# EAGLE design boardv1 (EAGLE 7.4.0)
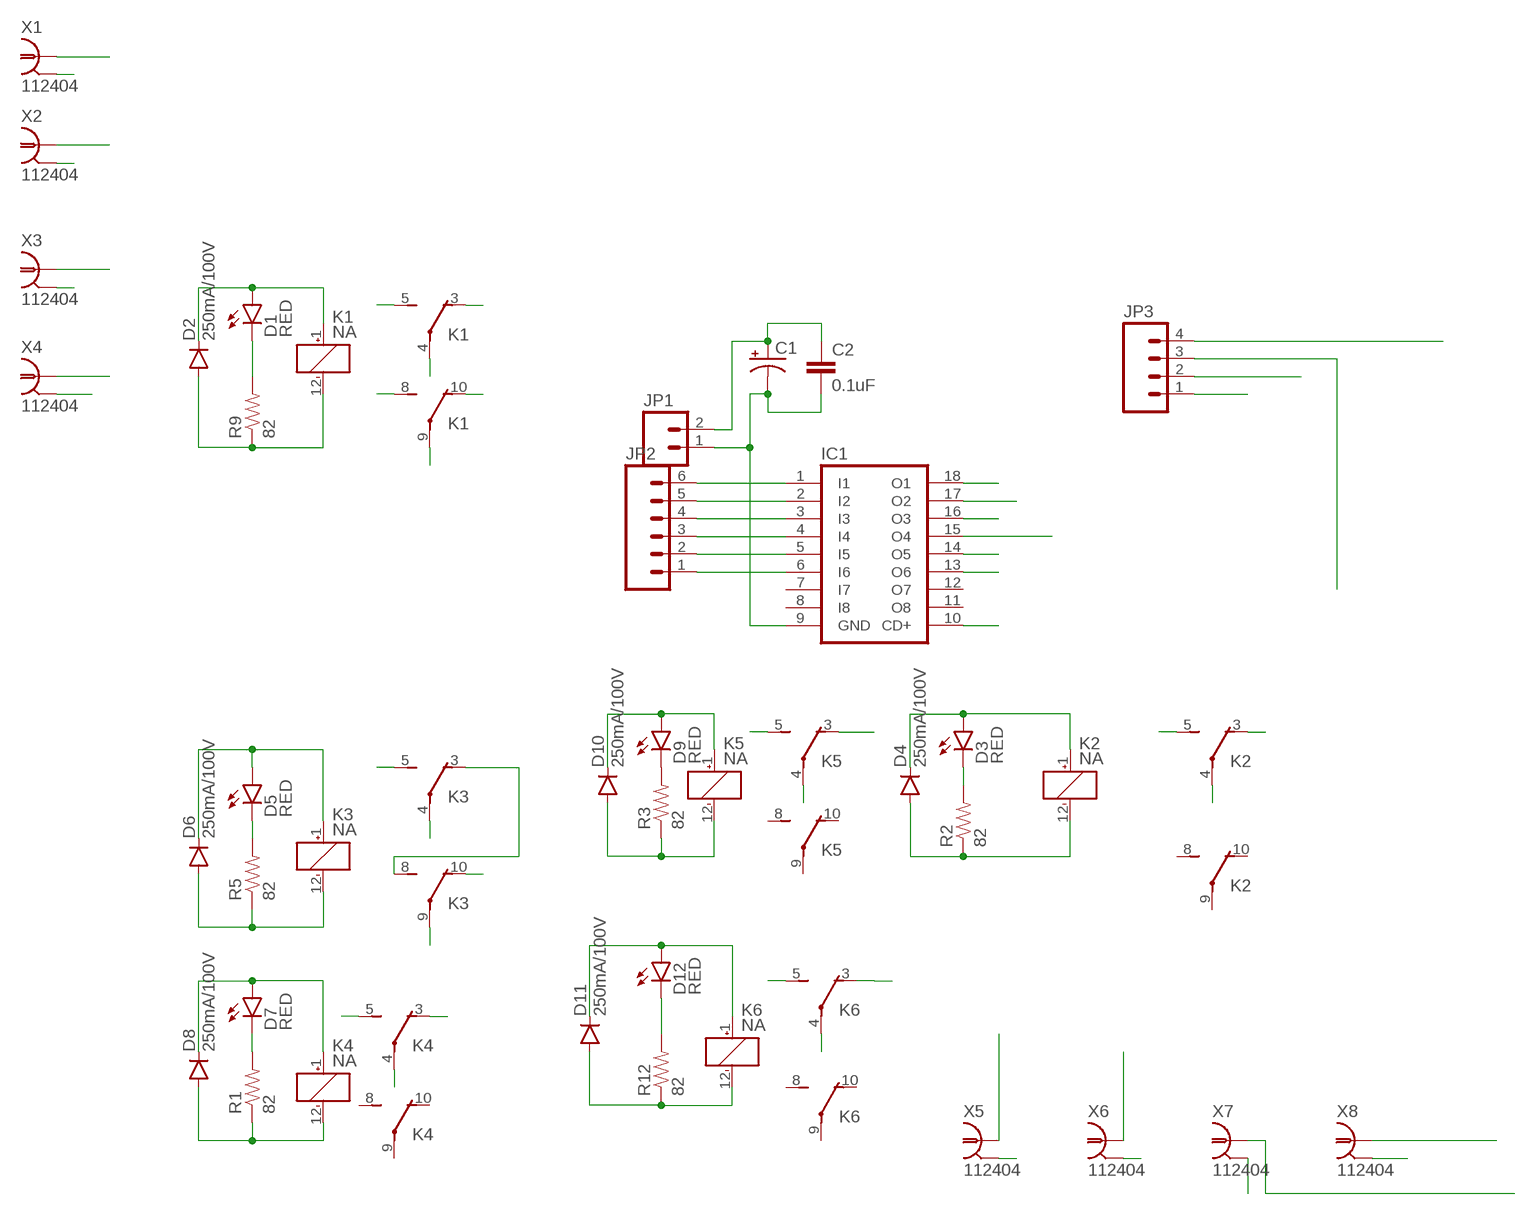
[diagram p0: schematic, sheet 1]

## Parts
C1  100UF-25V-20%(PTH)  [CPOL-RADIAL-100UF-25V]
C2  0.1uF  0.1UF-25V-5%(0603)  [0603-CAP]
D1  RED  LED-RED1206  [LED-1206]
D2  250mA/100V  DIODEBAS16  [SOD-323]
D3  RED  LED-RED1206  [LED-1206]
D4  250mA/100V  DIODEBAS16  [SOD-323]
D5  RED  LED-RED1206  [LED-1206]
D6  250mA/100V  DIODEBAS16  [SOD-323]
D7  RED  LED-RED1206  [LED-1206]
D8  250mA/100V  DIODEBAS16  [SOD-323]
D9  RED  LED-RED1206  [LED-1206]
D10  250mA/100V  DIODEBAS16  [SOD-323]
D11  250mA/100V  DIODEBAS16  [SOD-323]
D12  RED  LED-RED1206  [LED-1206]
IC1  ULN2803A  [DIL18]
JP1  M02PTH  [1X02]
JP2  M06NO_SILK_YES_STOP  [1X06_NO_SILK_YES_STOP]
JP3  M04PTH  [1X04]
K1  NA  [NA]
K2  NA  [NA]
K3  NA  [NA]
K4  NA  [NA]
K5  NA  [NA]
K6  NA  [NA]
R1  82  82OHM-1/10W-1%(0603)SMD  [0603-RES]
R2  82  82OHM-1/10W-1%(0603)SMD  [0603-RES]
R3  82  82OHM-1/10W-1%(0603)SMD  [0603-RES]
R5  82  82OHM-1/10W-1%(0603)SMD  [0603-RES]
R9  82  82OHM-1/10W-1%(0603)SMD  [0603-RES]
R12  82  82OHM-1/10W-1%(0603)SMD  [0603-RES]
X1  112404  [112404]
X2  112404  [112404]
X3  112404  [112404]
X4  112404  [112404]
X5  112404  [112404]
X6  112404  [112404]
X7  112404  [112404]
X8  112404  [112404]

## Nets
ARDUINO1: JP3.4 K2.3(2:O)
ARDUINO2: JP3.3 K6.3(2:O)
ARDUINO3: JP3.2 K5.3(2:O)
ARDUINO4: JP3.1 K4.3(2:O)
GND: X1.2 X1.3 X1.4 X1.5 X2.2 X2.3 X2.4 X2.5 X3.2 X3.3 X3.4 X3.5 X4.2 X4.3 X4.4 X4.5 X5.2 X5.3 X5.4 X5.5 X6.2 X6.3 X6.4 X6.5 X7.2 X7.3 X7.4 X7.5 X8.2 X8.3 X8.4 X8.5
GND2: C1.2(-) C2.2 IC1.9(GND) JP1.1
INPUTA: K1.4(2:P) X1.1
INPUTB: K1.9(3:P) X2.1
N$3: D1.C R9.2
N$4: D12.C R12.2
N$5: D5.C R5.2
N$6: D9.C R3.2
N$7: D7.C R1.2
N$8: IC1.6(I6) JP2.1
N$9: IC1.1(I1) JP2.6
N$10: IC1.2(I2) JP2.5
N$11: IC1.3(I3) JP2.4
N$14: D3.C R2.2
N$24: IC1.4(I4) JP2.3
N$25: IC1.5(I5) JP2.2
OUTPUT1: K4.4(2:P) X5.1
OUTPUT2: K5.4(2:P) X6.1
OUTPUT3: K6.4(2:P) X7.1
OUTPUT4: K2.4(2:P) X8.1
OUTPUTA: K1.3(2:O) K3.5(2:S) X3.1
OUTPUTB: K1.10(3:O) K3.10(3:O) X4.1
R1: D4.A IC1.18(O1) K2.12(1:-) R2.1
R2: D11.A IC1.17(O2) K6.12(1:-) R12.1
R3: D10.A IC1.16(O3) K5.12(1:-) R3.1
R4: D8.A IC1.15(O4) K4.12(1:-) R1.1
R5: D6.A IC1.14(O5) K3.12(1:-) R5.1
R6: D2.A IC1.13(O6) K1.12(1:-) R9.1
SIG3A: K1.5(2:S) K3.4(2:P)
SIG3B: K1.8(3:S) K3.9(3:P)
SIG4A: K2.5(2:S) K3.3(2:O) K3.8(3:S) K4.5(2:S) K5.5(2:S) K6.5(2:S)
VCC: C1.1(+) C2.1 D1.A D2.C D3.A D4.C D5.A D6.C D7.A D8.C D9.A D10.C D11.C D12.A IC1.10(CD+) JP1.2 K1.1(1:+) K2.1(1:+) K3.1(1:+) K4.1(1:+) K5.1(1:+) K6.1(1:+)
Unconnected: IC1.7(I7) IC1.8(I8) IC1.11(O8) IC1.12(O7) K2.8(3:S) K2.9(3:P) K2.10(3:O) K4.8(3:S) K4.9(3:P) K4.10(3:O) K5.8(3:S) K5.9(3:P) K5.10(3:O) K6.8(3:S) K6.9(3:P) K6.10(3:O)

## Library data of the parts
C1 = SparkFun-Capacitors:100UF-25V-20%(PTH): CAP-08439; PROD_ID: CAP-08439
C2 = SparkFun-Capacitors:0.1UF-25V-5%(0603): CAP-08604; PROD_ID: CAP-08604
D1 D3 D5 D7 D9 D12 = SparkFun-LED:LED-RED: Assorted Red LEDs LilyPad 1206- DIO-09912 1206- DIO-00809 0603- DIO-00819 "SMART" means more efficient and expensive; PROD_ID: DIO-09912
D2 D4 D6 D8 D10 D11 = SparkFun-DiscreteSemi:DIODE: Diode These are standard reverse protection diodes and small signal diodes. SMA package can handle up to about 1A. SOD-323 can handle about 200mA. What the SOD-323 package when ordering, there are some mfgs out there that are 5-pin packages.; PROD_ID: DIO-09646
IC1 = uln-udn:ULN2803A: DRIVER ARRAY
JP1 = SparkFun-Connectors:M02: Standard 2-pin 0.1" header. Use with - straight break away headers ( PRT-00116) - right angle break away headers (PRT-00553) - swiss pins (PRT-00743) - machine pins (PRT-00117) - female headers (PRT-00115) Molex polarized connector foot print use with: PRT-08233 with associated crimp pins and housings. 2.54_SCREWTERM for use with PRT-10571. 3.5mm Screw Terminal footprints for PRT-08084 5mm Screw Terminal footprints for use with PRT-08432
JP2 = SparkFun-Connectors:M06: Header 6 Standard 6-pin 0.1" header. Use with straight break away headers (SKU : PRT-00116), right angle break away headers (PRT-00553), swiss pins (PRT-00743), machine pins (PRT-00117), and female headers (PRT-00115). Molex polarized connector foot print use with SKU : PRT-08094 with associated crimp pins and housings. NOTES ON THE VARIANTS LOCK and LOCK_LONGPADS... This footprint was designed to help hold the alignment of a through-hole component (i.e. 6-pin header) while soldering it into place. You may notice that each hole has been shifted either up or down by 0.005 of an inch from it's more standard position (which is a perfectly straight line). This slight alteration caused the pins (the squares in the middle) to touch the edges of the holes. Because they are alternating, it causes a "brace" to hold the component in place. 0.005 has proven to be the perfect amount of "off-center" position when using our standard breakaway headers. Although looks a little odd when you look at the bare footprint, once you have a header in there, the alteration is very hard to notice. Also,if you push a header all the way into place, it is covered up entirely on the bottom side. This idea of altering the position of holes to aid alignment will be further integrated into the Sparkfun Library for other footprints. It can help hold any component with 3 or more connection pins.
JP3 = SparkFun-Connectors:M04: Header 4 Standard 4-pin 0.1" header. Use with straight break away headers (SKU : PRT-00116), right angle break away headers (PRT-00553), swiss pins (PRT-00743), machine pins (PRT-00117), and female headers (PRT-00115). Molex polarized connector foot print use with SKU : PRT-08231 with associated crimp pins and housings. 1MM SMD Version SKU: PRT-10208
K1-K6 = relay:NA: RELAY; OC_FARNELL: unknown; OC_NEWARK: unknown
R1-R3 R5 R9 R12 = SparkFun-Resistors:82OHM-1/10W-1%(0603): RES-12311; PROD_ID: RES-12311
X1-X8 = amphenol-112404_10:112404: Amphenol Connex 112404 BNC P. C. Mount Recept. Jack Source: http://www.amphenolconnex.com/media/downloads/3157/112404.pdf; MF: Amphenol Connex; MPN: 112404; OC_FARNELL: 1583381; OC_NEWARK: 99H4363

## Board
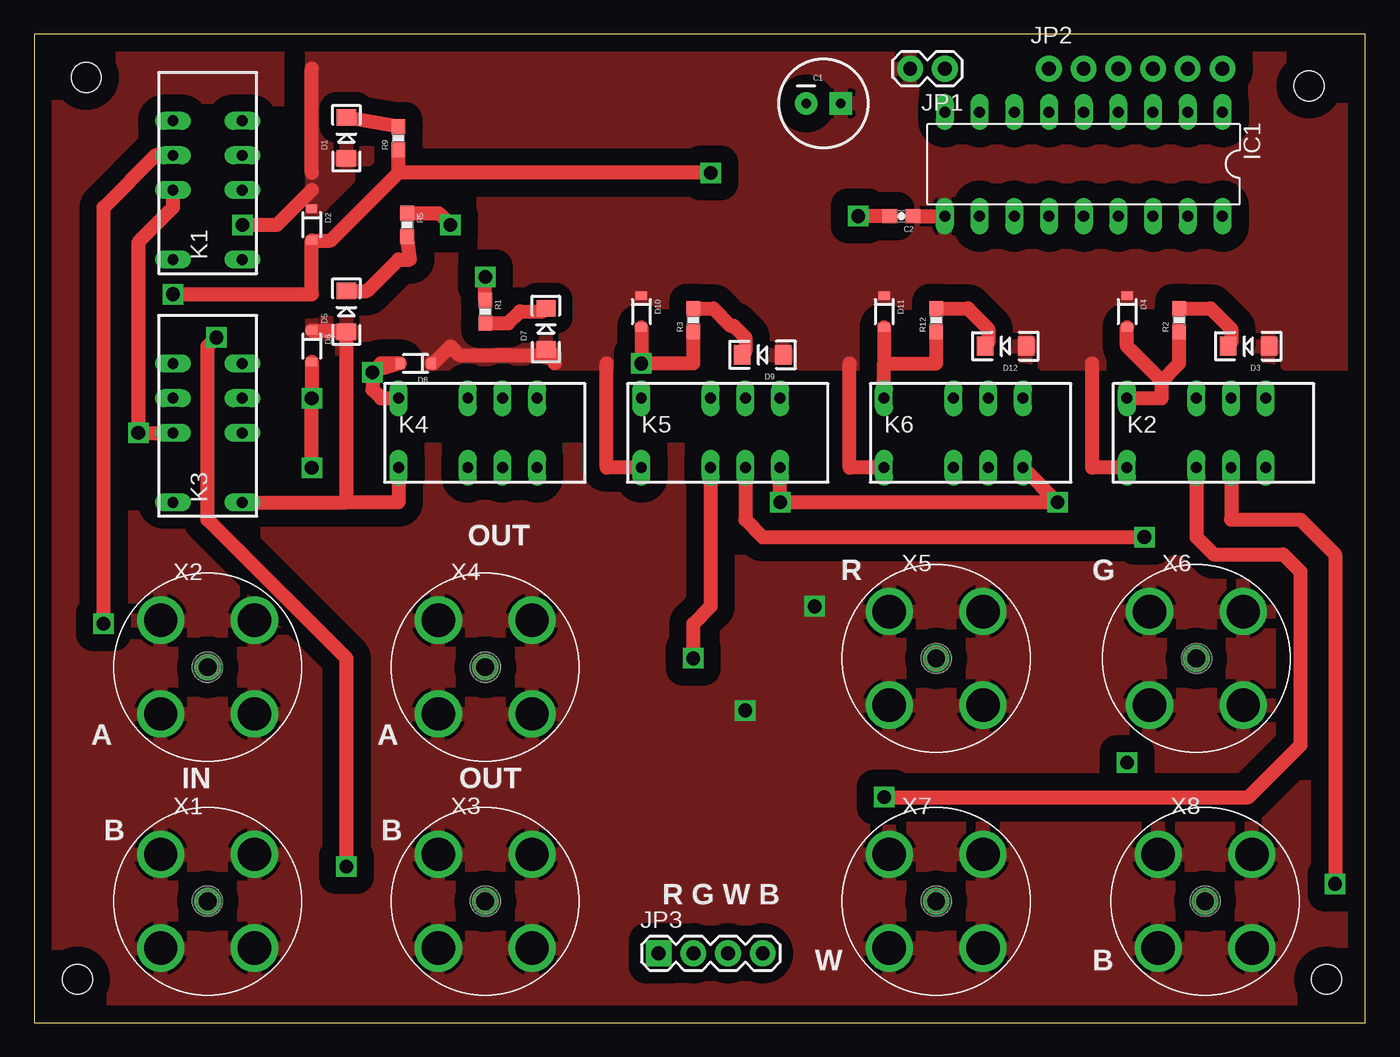
[diagram p1: board, top side]
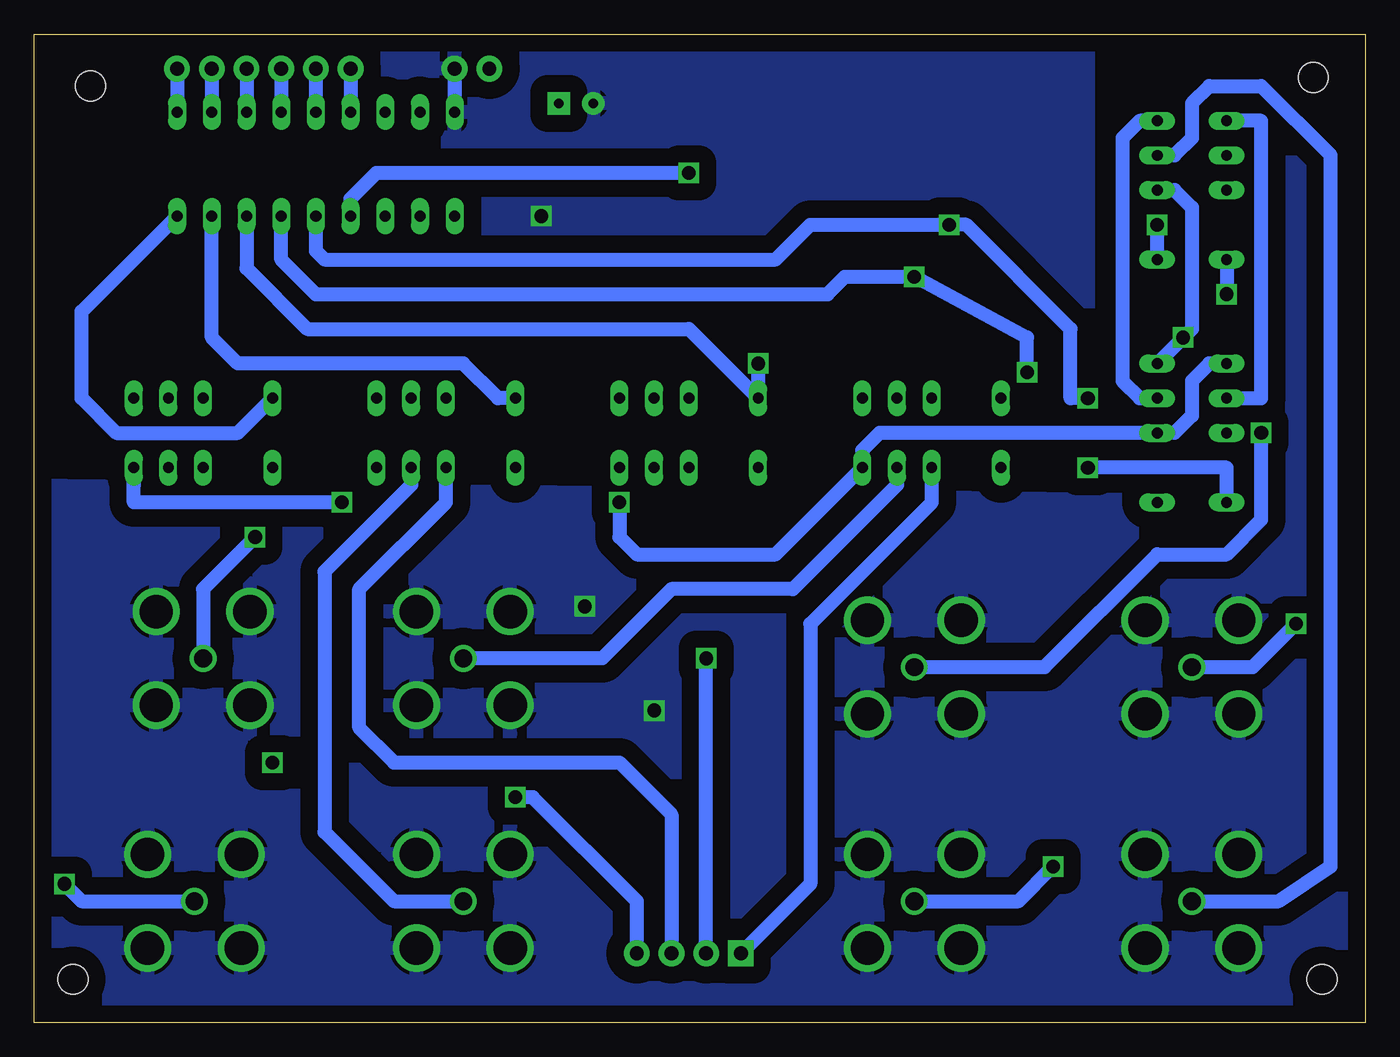
[diagram p2: board, bottom side, seen from below]

Size 97.46 x 72.38 mm. Coordinates in mm from the lower left corner, seen from the top.
Outline: 0,0 97.46,0 97.46,72.38 0,72.38 0,0
Copper layers (1*16): Top 0.035mm / dielectric 1.5mm / Bottom 0.035mm
Design rules "default": minimum track width 10mil, minimum drill 24mil, track to track 8mil, track to pad 8mil, pad to pad 8mil, via to via 8mil, smd to smd 8mil, copper to edge 40mil, drill to drill 8mil, minimum pad ring 10mil, minimum via ring 8mil, stop-mask expansion 4mil, vias tented up to drill 0mil, thermal gap 10mil
Holes 2.2 mm at 3.81,69.22 3.18,3.17 93.34,68.58 94.62,3.17

### Footprints (pad centres in the part's own frame; a part is rotated, then mirrored left to right if it is on the bottom)
CPOL-RADIAL-100UF-25V = drill 0.7 pad 1.651 square: 1 1.27,0 | drill 0.7 pad 1.651: 2 -1.27,0
0603-CAP = smd 1.1 x 1: 1 -0.85,0; 2 0.85,0
LED-1206 = smd 1.2 x 1.4: A -1.5,0; C 1.5,0
SOD-323 = smd 0.63 x 0.83: A 1.15,0; C -1.15,0
DIL18 = drill 0.813 long: 1 -10.16,-3.81; 2 -7.62,-3.81; 3 -5.08,-3.81; 4 -2.54,-3.81; 5 0,-3.81; 6 2.54,-3.81; 7 5.08,-3.81; 8 7.62,-3.81; 9 10.16,-3.81; 10 10.16,3.81; 11 7.62,3.81; 12 5.08,3.81; 13 2.54,3.81; 14 0,3.81; 15 -2.54,3.81; 16 -5.08,3.81; 17 -7.62,3.81; 18 -10.16,3.81
1X02 = drill 1.016 pad 1.88: 1 0,0; 2 2.54,0
1X06_NO_SILK_YES_STOP = drill 1.016 pad 1.88: 1 0,0; 2 2.54,0; 3 5.08,0; 4 7.62,0; 5 10.16,0; 6 12.7,0
1X04 = drill 1.016 pad 1.88 square: 1 0,0 | drill 1.016 pad 1.88: 2 2.54,0; 3 5.08,0; 4 7.62,0
NA = drill 0.8 long: 1 -6.35,-2.54; 3 -1.27,-2.54; 4 1.27,-2.54; 5 3.81,-2.54; 8 3.81,2.54; 9 1.27,2.54; 10 -1.27,2.54; 12 -6.35,2.54
0603-RES = smd 1.1 x 1: 1 -0.85,0; 2 0.85,0
112404 = drill 1.3: 1 0,0 | drill 2.44: 2 -3.43,3.43; 3 3.43,3.43; 4 3.43,-3.43; 5 -3.43,-3.43

### Placement (x,y rotation side)
C1  57.78,67.31 0 top
C2  63.5,59.05 180 top
D1  22.86,64.77 90 top
D2  20.32,58.42 270 top
D3  88.9,49.53 180 top
D4  80.01,52.07 270 top
D5  22.86,52.07 90 top
D6  20.32,49.53 270 top
D7  37.46,50.8 90 top
D8  27.94,48.26 180 top
D9  53.34,48.9 180 top
D10  44.45,52.07 270 top
D11  62.23,52.07 270 top
D12  71.12,49.53 180 top
IC1  76.84,62.87 180 top
JP1  66.67,69.85 180 top
JP2  74.3,69.85 0 top
JP3  45.72,5.08 0 top
K1  12.7,62.23 90 top
K2  86.36,43.18 0 top
K3  12.7,44.45 90 top
K4  33.02,43.18 0 top
K5  50.8,43.18 0 top
K6  68.58,43.18 0 top
R1  33.02,52.07 270 top
R2  83.82,51.44 90 top
R3  48.26,51.44 90 top
R5  27.3,58.42 270 top
R9  26.67,64.77 90 top
R12  66.04,51.44 90 top
X1  12.7,8.89 0 top
X2  12.7,26.04 0 top
X3  33.02,8.89 0 top
X4  33.02,26.04 0 top
X5  66.04,26.67 0 top
X6  85.09,26.67 0 top
X7  66.04,8.89 0 top
X8  85.73,8.89 0 top

### Tracks (layer width: path | path; a pad name or v marks a point on that pad's centre or on a via)
ARDUINO1  (via drill 1)
  Top 1.016: K2.3 85.09,35.56 86.36,34.29 91.44,34.29 92.71,33.02 92.71,20.32 88.9,16.51 v62.23,16.51
  Bottom 1.016: JP3.4 53.34,8.89 60.96,16.51 v62.23,16.51
ARDUINO2
  Bottom 1.016: K6.3 67.31,38.1 73.66,31.75 73.66,21.59 71.12,19.05 54.61,19.05 50.8,15.24 JP3.3
ARDUINO3  (via drill 1)
  Top 1.016: K5.3 49.53,30.48 48.26,29.21 v48.26,26.67
  Bottom 1.016: JP3.2 v48.26,26.67
ARDUINO4
  Bottom 1.016: K4.3 31.75,38.1 40.64,29.21 40.64,10.16 JP3.1
GND  (via drill 1)
  other vias: 57.15,30.48 52.07,22.86
  pour Bottom (isolate 1.27): 1.27,38.1 1.27,0 97.79,0 97.79,39.37
  pour Bottom (isolate 1.27): 12.7,71.12 12.7,22.86 -2.54,22.86 -2.54,71.12
  pour Top (isolate 1.27): 97.79,41.91 -2.54,41.91 -2.54,1.27 97.79,1.27
  pour Top (isolate 1.27): 1.27,11.43 1.27,71.12 17.78,71.12 17.78,11.43
  pour Top (isolate 1.27): 1.27,11.43 1.27,71.12 17.78,71.12 17.78,11.43
GND2  (via drill 1)
  Top 1.016: C2.2 v60.32,59.05
  Bottom 1.016: JP1.1 IC1.9
  pour Bottom (isolate 1.27): 20.32,72.39 20.32,48.26 96.52,48.26 96.52,72.39
INPUTA
  Bottom 1.016: X1.1 6.35,8.89 2.54,11.43 2.54,63.5 7.62,68.58 11.43,68.58 12.7,67.31 12.7,64.77 13.97,63.5 K1.4
INPUTB  (via drill 1)
  Top 1.016: K1.9 8.89,63.5 5.08,59.69 v5.08,29.21
  Bottom 1.016: X2.1 8.26,26.04 v5.08,29.21
N$1  (via drill 1)
  other vias: 80.01,19.05
N$3
  Top 1.016: R9.2 D1.C
N$4
  Top 1.016: R12.2 68.37,52.29 69.85,50.8 69.85,49.76 D12.C
N$5
  Top 1.016: D5.C 24.36,53.57 26.67,55.88 27.52,55.88 R5.2
N$6
  Top 1.016: R3.2 49.72,52.29 50.99,51.02 51.22,51.02 52.07,50.16 52.07,49.12 D9.C
N$7
  Top 1.016: R1.2 34.71,51.22 35.56,52.07 37.23,52.07 D7.C
N$8
  Bottom 1.016: JP2.1 IC1.6
N$9
  Bottom 1.016: JP2.6 IC1.1
N$10
  Bottom 1.016: JP2.5 IC1.2
N$11
  Bottom 1.016: JP2.4 IC1.3
N$14
  Top 1.016: R2.2 86.15,52.29 87.63,50.8 87.63,49.76 D3.C
N$24
  Bottom 1.016: JP2.3 IC1.4
N$25
  Bottom 1.016: JP2.2 IC1.5
OUTPUT1
  Bottom 1.016: K4.4 34.29,39.37 41.91,31.75 50.8,31.75 55.88,26.67 X5.1
OUTPUT2  (via drill 1)
  Top 1.016: K5.4 52.07,36.83 53.34,35.56 v81.28,35.56
  Bottom 1.016: v81.28,35.56 85.09,31.75 X6.1
OUTPUT3
  Bottom 1.016: X7.1 71.12,8.89 76.2,13.97 76.2,33.02 69.85,39.37 K6.4
OUTPUT4  (via drill 1)
  Top 1.016: K2.4 87.63,36.83 92.71,36.83 95.25,34.29 v95.25,10.16
  Bottom 1.016: X8.1 93.98,8.89 v95.25,10.16
OUTPUTA  (via drill 1)
  Top 1.016: v22.86,11.43 22.86,26.67 12.7,36.83 12.7,49.53 v13.34,50.16
  Bottom 1.016: K1.3 13.97,60.96 12.7,59.69 12.7,50.8 v13.34,50.16 K3.5 | X3.1 25.4,8.89 v22.86,11.43
OUTPUTB  (via drill 1)
  Top 1.016: K1.10 10.16,59.69 7.62,57.15 v7.62,43.18 K3.10
  Bottom 1.016: X4.1 23.5,26.04 15.24,34.29 10.16,34.29 7.62,36.83 v7.62,43.18
R1
  Top 1.016: K2.12 82.55,45.72 82.55,46.99 | R2.1 83.82,48.26 82.55,46.99 | 82.55,46.99 80.01,49.53 D4.A
  Bottom 1.016: K2.12 82.55,43.18 91.44,43.18 93.98,45.72 93.98,52.07 IC1.18
R2
  Top 1.016: K6.12 62.23,48.26 | D11.A 62.23,48.26 | 62.23,48.26 66.04,48.26 R12.1
  Bottom 1.016: K6.12 63.5,45.72 66.04,48.26 82.55,48.26 84.45,50.16 IC1.17
R3  (via drill 1)
  Top 1.016: D10.A v44.45,48.26 48.26,48.26 R3.1
  Bottom 1.016: v44.45,48.26 K5.12 49.53,50.8 77.47,50.8 81.92,55.25 IC1.16
R4  (via drill 1)
  Top 1.016: v24.77,47.62 D8.A 25.4,48.26 v24.77,47.62 | v24.77,47.62 24.77,46.36 25.4,45.72 K4.12 | R1.1 v33.02,54.61
  Bottom 1.016: v24.77,47.62 24.77,50.16 v33.02,54.61 38.1,54.61 39.37,53.34 76.84,53.34 79.38,55.88 IC1.15
R5  (via drill 1)
  Top 1.016: v20.32,40.64 v20.32,45.72 D6.A | R5.1 29.63,59.27 v30.48,58.42
  Bottom 1.016: v20.32,45.72 21.59,45.72 21.59,50.8 29.21,58.42 v30.48,58.42 40.64,58.42 43.18,55.88 76.2,55.88 76.84,56.52 IC1.14 | K3.12 10.16,40.64 v20.32,40.64
R6  (via drill 1)
  Top 1.016: v10.16,53.34 20.32,53.34 D2.A 21.71,57.27 26.67,62.23 | 26.67,62.23 R9.1 | v49.53,62.23 26.67,62.23
  Bottom 1.016: K1.12 v10.16,53.34 | IC1.13 74.3,60.33 72.39,62.23 v49.53,62.23
SIG3A
  Bottom 1.016: K1.5 16.51,66.04 17.78,64.77 17.78,46.99 16.51,45.72 K3.4
SIG3B
  Bottom 1.016: K3.9 7.62,45.72 7.62,66.04 K1.8
SIG4A  (via drill 1)
  Top 1.016: K5.5 v54.61,38.1 v74.93,38.1 K6.5
  Bottom 1.016: K3.8 11.43,48.26 12.7,46.99 12.7,44.45 13.97,43.18 K3.3 35.56,43.18 36.83,41.91 K4.5 43.18,34.29 53.34,34.29 54.61,35.56 v54.61,38.1 | 90.17,39.37 K2.5 90.17,38.1 v74.93,38.1
VCC  (via drill 1)
  Top 1.016: K3.1 22.86,38.1 | 22.86,38.1 D5.A 22.75,50.68 D6.C | K4.1 26.67,38.1 22.86,38.1 | K5.1 41.91,40.64 41.91,48.26 | K6.1 59.69,40.64 59.69,48.26 | K2.1 77.47,40.64 77.47,48.26 | D8.C 29.21,48.26 30.48,49.53 31.11,48.9 38.1,48.9 38.1,48.66 | 38.1,48.26 38.1,48.66 | 38.1,48.66 D7.A | 20.32,62.23 20.32,69.85 | v15.24,58.42 17.78,58.42 20.32,60.96 | C2.1 IC1.10
  Bottom 1.016: K1.1 v15.24,58.42
  pour Top (isolate 1.27): 101.6,71.12 20.32,71.12 20.32,48.26 101.6,48.26

### Text on the board
tPlace: OUT | R | G | A | A | IN | OUT | B | B | R G W B | W | B